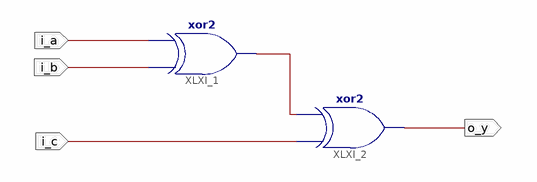
[diagram p0: schematic sheet 1]
// Xilinx ISE schematic test.sch (spartan3e) as structural Verilog: 2 symbols, 4 ports
module test (
  input  i_a,
  input  i_b,
  input  i_c,
  output o_y
);

  wire XLXN_4;

  xor XLXI_1 (XLXN_4, i_b, i_a);
  xor XLXI_2 (o_y, i_c, XLXN_4);
endmodule
